# Altium schematic sheet bop_it_sch.SchDoc
size A; SheetNumber: 1; SheetTotal: 1
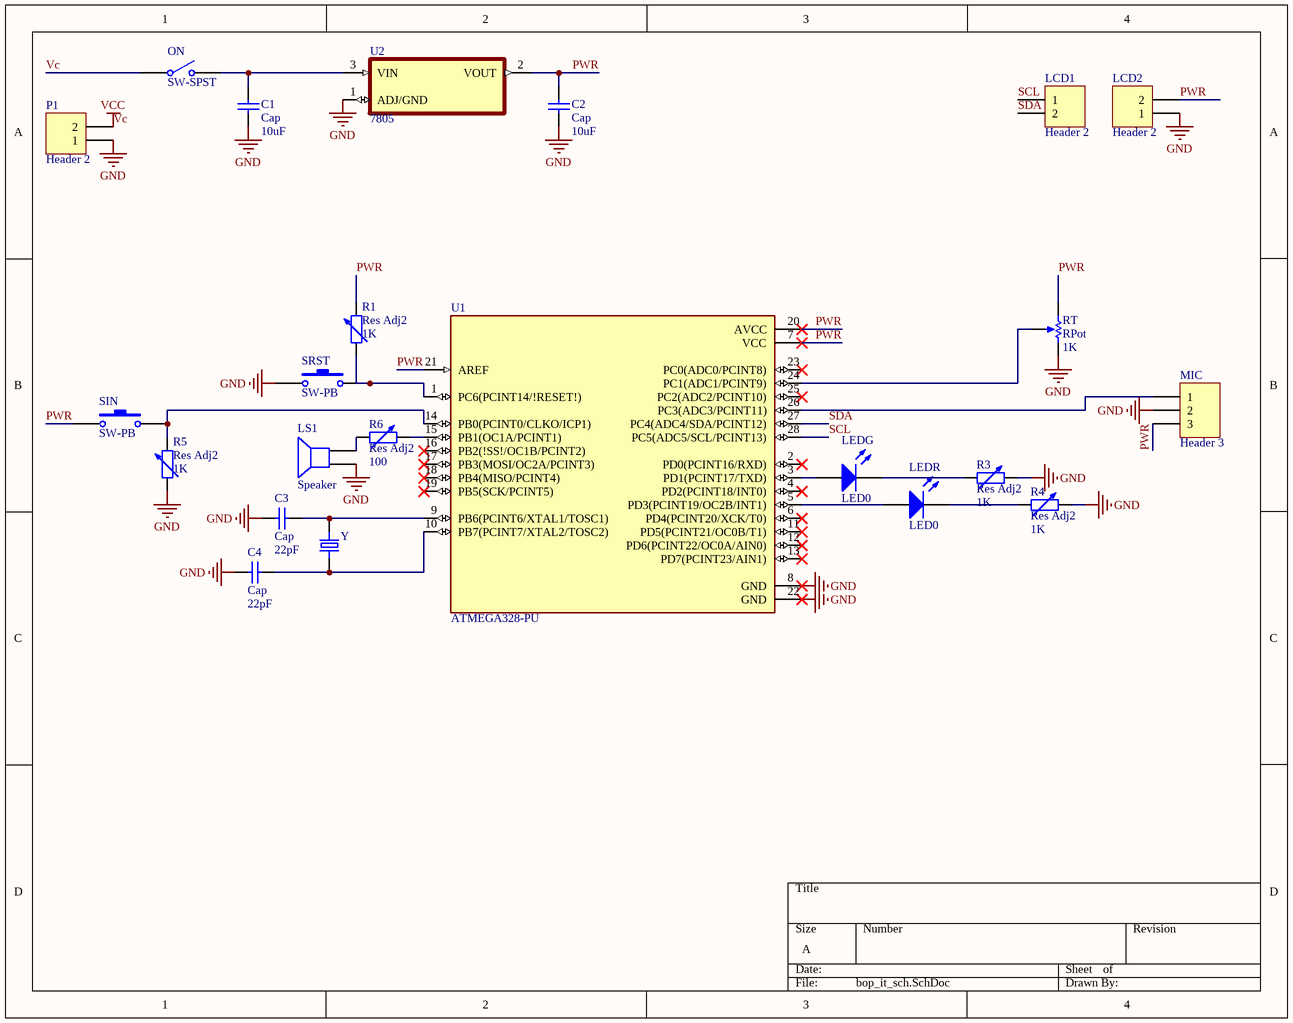
[diagram p0: bop_it_sch.SchDoc]

## Parts
C1  Cap  value 10uF  [RAD-0.3]
C2  Cap  value 10uF  [RAD-0.3]
C3  Cap  value 22pF  [RAD-0.3]
C4  Cap  value 22pF  [RAD-0.3]
LCD1  Header 2  [HDR1X2]
LCD2  Header 2  [HDR1X2]
LEDG  LED0  [LED-0]
LEDR  LED0  [LED-0]
LS1  Speaker  [PIN2]
MIC  Header 3  [HDR1X3]
ON  SW-SPST  [SPST-2]
P1  Header 2  [HDR1X2]
R1  Res Adj2  value 1K  [AXIAL-0.6]
R3  Res Adj2  value 1K  [AXIAL-0.6]
R4  Res Adj2  value 1K  [AXIAL-0.6]
R5  Res Adj2  value 1K  [AXIAL-0.6]
R6  Res Adj2  value 100  [AXIAL-0.6]
RT  RPot  value 1K  [VR5]
SIN  SW-PB  [SPST-2]
SRST  SW-PB  [SPST-2]
U1  ATMEGA328-PU  [DIP787W46P254L3467H508Q28]
U2  7805  [TO254P1054X470X1955-3]
Y  ECS-240.0001-18-1X  [XTAL_ECS-200-20-1X]  (value not drawn)

## Nets
GND: C1.1 C2.1 C3.1 C4.1 LCD2.1 LS1.1 MIC.2 P1.1 R3.2 R4.2 R5.1 RT.2(BOT) SRST.1 U1.8(GND) U1.22(GND) U2.1(ADJ/GND)
Vc: ON.1(COMMON) P1.2  [also labelled VCC]
PWR: C2.2 LCD2.2 MIC.3 R1.2 RT.1(TOP) SIN.1 U1.7(VCC) U1.20(AVCC) U1.21(AREF) U2.2(VOUT)
SCL: LCD1.1 U1.28(PC5(ADC5/SCL/PCINT13))
SDA: LCD1.2 U1.27(PC4(ADC4/SDA/PCINT12))
NetC1_2: C1.2 ON.2(NO) U2.3(VIN)
NetC3_2: C3.2 U1.9(PB6(PCINT6/XTAL1/TOSC1)) Y.2
NetC4_2: C4.2 U1.10(PB7(PCINT7/XTAL2/TOSC2)) Y.1
NetLEDG_1: LEDG.1(A) U1.3(PD1(PCINT17/TXD))
NetLEDG_2: LEDG.2(K) R3.1
NetLEDR_1: LEDR.1(A) U1.5(PD3(PCINT19/OC2B/INT1))
NetLEDR_2: LEDR.2(K) R4.1
NetLS1_2: LS1.2 R6.1
NetMIC_1: MIC.1 U1.26(PC3(ADC3/PCINT11))
NetR1_1: R1.1 SRST.2 U1.1(PC6(PCINT14/!RESET!))
NetR5_2: R5.2 SIN.2 U1.14(PB0(PCINT0/CLKO/ICP1))
NetR6_2: R6.2 U1.15(PB1(OC1A/PCINT1))
NetRT_3: RT.3(TAP) U1.24(PC1(ADC1/PCINT9))

Not connected (* = marked no-connect by the designer): U1 2(PD0(PCINT16/RXD))* 4(PD2(PCINT18/INT0))* 6(PD4(PCINT20/XCK/T0))* 11(PD5(PCINT21/OC0B/T1))* 12(PD6(PCINT22/OC0A/AIN0))* 13(PD7(PCINT23/AIN1))* 16(PB2(!SS!/OC1B/PCINT2))* 17(PB3(MOSI/OC2A/PCINT3))* 18(PB4(MISO/PCINT4))* 19(PB5(SCK/PCINT5))* 23(PC0(ADC0/PCINT8))* 25(PC2(ADC2/PCINT10))*

## Library data of the parts
C1-C4 = Cap: Capacitor; Published: 8-Jun-2000; LatestRevisionDate: 17-Jul-2002; LatestRevisionNote: Re-released for DXP Platform.; PackageReference: RAD-0.3; Publisher: Altium Limited; PackageDescription: Radial Cap, Thru-Hole; 2 Leads; 0.3 in Pin Spacing
LCD1 LCD2 P1 = Header 2: Header, 2-Pin; LatestRevisionDate: 17-Jul-2002; LatestRevisionNote: Re-released for DXP Platform.; Publisher: Altium Limited
LEDG LEDR = LED0: Typical INFRARED GaAs LED; Published: 8-Jun-2000; LatestRevisionDate: 08-Jul-2005; LatestRevisionNote: Mech Layer 1 removed.; PackageReference: LED-0; Publisher: Altium Limited; PackageDescription: LED; 2 Leads
LS1 = Speaker: Loudspeaker; Published: 24-Mar-1999; LatestRevisionDate: 17-Jul-2002; LatestRevisionNote: Re-released for DXP Platform.; PackageReference: PIN2; Publisher: Altium Limited
MIC = Header 3: Header, 3-Pin; LatestRevisionDate: 17-Jul-2002; LatestRevisionNote: Re-released for DXP Platform.; Publisher: Altium Limited
ON = SW-SPST: Single-Pole, Single-Throw Switch; Published: 24-Mar-1999; LatestRevisionDate: 17-Jul-2002; LatestRevisionNote: Re-released for DXP Platform.; PackageReference: SPST-2; Publisher: Altium Limited; PackageDescription: Switch; 2 Leads
R1 R3-R6 = Res Adj2: Variable Resistor; Set Position: 0.5; Published: 8-Jun-2000; LatestRevisionDate: 17-Jul-2002; LatestRevisionNote: Re-released for DXP Platform.; PackageReference: AXIAL-0.6; Publisher: Altium Limited; PackageDescription: Axial Device, Thru-Hole; 2 Leads; 0.6 in Pin Spacing
RT = RPot: Potentiometer; Sim Note: Enter the Resistance value and the set point into parameter fields.; Set Position: 0.5; Published: 8-Jun-2000; LatestRevisionDate: 17-Jul-2002; LatestRevisionNote: Re-released for DXP Platform.; PackageReference: VR5; Publisher: Altium Limited; PackageDescription: Variable Resistor, Thru-Hole; 3 Leads
SIN SRST = SW-PB: Switch; Published: 24-Mar-1999; LatestRevisionDate: 17-Jul-2002; LatestRevisionNote: Re-released for DXP Platform.; PackageReference: SPST-2; Publisher: Altium Limited; PackageDescription: Switch; 2 Leads
U1 = ATMEGA328-PU: AVR AVRÂ® ATmega Microcontroller IC 8-Bit 20MHz 32KB (16K x 16) FLASH 28-PDIP; MF: Microchip Technology; Value: *; Check_prices: https://www.snapeda.com/parts/ATMEGA328-PU/Microchip/view-part/4833845/?ref=eda; Availability: Good; Package: DIP-28 Microchip Technology; SnapEDA_Link: https://www.snapeda.com/parts/ATMEGA328-PU/Microchip/view-part/4833845/?ref=snap; Purchase-URL: https://pricing.snapeda.com/search/part/ATMEGA328-PU/?ref=eda; Price: None; MP: ATMEGA328-PU
U2 = LM1085IT-5.0: 3-A, 29-V, linear voltage regulator 3-TO-220; MF: Texas Instruments; SnapEDA_Link: https://www.snapeda.com/parts/LM1085IT-5.0/Texas%20Instruments/view-part/226095/?ref=snap; Price: None; MP: LM1085IT-5.0; Availability: Warning; Value: *; Purchase-URL: https://pricing.snapeda.com/search/part/LM1085IT-5.0/?ref=eda; Package: TO-220-3 Texas Instruments
Y = ECS-240.0001-18-1X: Crystals / Oscillators / Resonators 24.00014MHz 18pF; MF: ECS International; Package: HC49/U ECS International; Availability: Unavailable; Value: *; MP: ECS-240.0001-18-1X; Price: None; SnapEDA_Link: https://www.snapeda.com/parts/ECS-240.0001-18-1X/ECS%20International/view-part/259232/?ref=snap